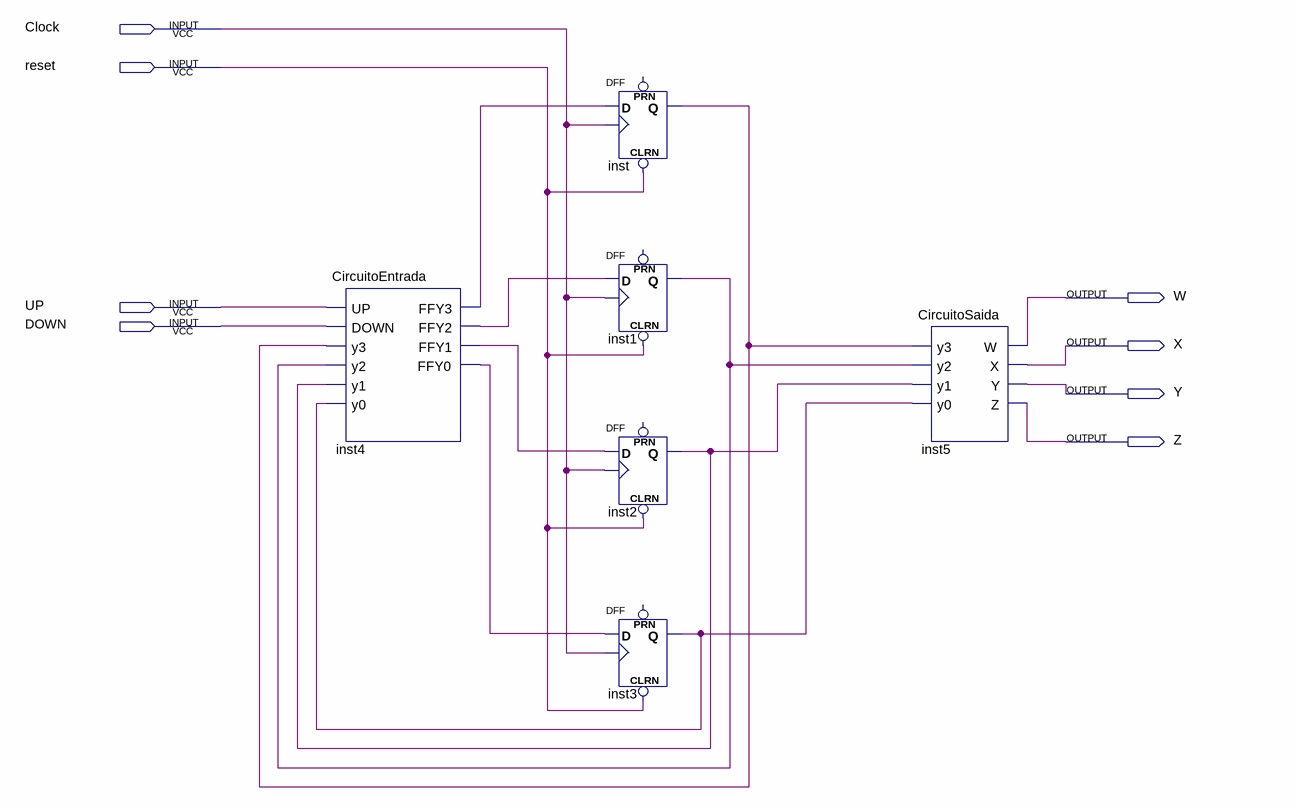
[diagram p0: schematic sheet]
// Quartus schematic MaquinaDeMoore.bdf as structural Verilog: 6 symbols, 8 pins
module MaquinaDeMoore (
  input  Clock,
  input  reset,
  input  UP,
  input  DOWN,
  output W,
  output X,
  output Y,
  output Z
);

  wire inst1_q, inst2_q, inst3_q, inst4_ffy0, inst4_ffy1, inst4_ffy2, inst4_ffy3, inst_q;

  CircuitoEntrada inst4 (
    .UP(UP), .DOWN(DOWN), .y3(inst_q), .y2(inst1_q), .y1(inst2_q), .y0(inst3_q), .FFY3(inst4_ffy3),
    .FFY2(inst4_ffy2), .FFY1(inst4_ffy1), .FFY0(inst4_ffy0));
  DFF inst (.CLRN(reset), .CLK(Clock), .D(inst4_ffy3), .Q(inst_q));  // open: PRN
  DFF inst1 (.CLRN(reset), .CLK(Clock), .D(inst4_ffy2), .Q(inst1_q));  // open: PRN
  DFF inst2 (.CLRN(reset), .CLK(Clock), .D(inst4_ffy1), .Q(inst2_q));  // open: PRN
  DFF inst3 (.CLRN(reset), .CLK(Clock), .D(inst4_ffy0), .Q(inst3_q));  // open: PRN
  CircuitoSaida inst5 (.y3(inst_q), .y2(inst1_q), .y1(inst2_q), .y0(inst3_q), .W(W), .X(X), .Y(Y), .Z(Z));
endmodule
